# Altium schematic sheet Power_LDO_2V5.SchDoc: 2.5V LDO
size Letter; Engineer: Nathan Petersen; DocumentNumber: 6; Revision: v1.2; SheetNumber: 6; SheetTotal: 30
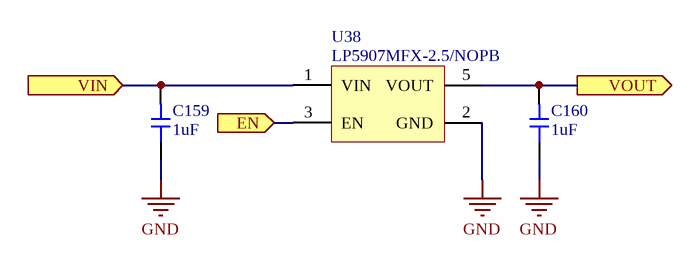
[diagram p0: Power_LDO_2V5.SchDoc]

## Parts
C159  value 1uF  [0603-CAP]  (hidden comment: Capacitor)
C160  value 1uF  [0603-CAP]  (hidden comment: Capacitor)
U38  LP5907MFX-2.5/NOPB  [SOT23-5]

## Ports
EN (in), VIN (in), VOUT (out)

## Nets
GND: C159.2 C160.2 U38.2(GND)
EN: U38.3(EN) ; port EN
VIN: C159.1 U38.1(VIN) ; port VIN
VOUT: C160.1 U38.5(VOUT) ; port VOUT

## Notes on the sheet
- Title:
- File:
- Sheet:
- of
- Revision:
- Time:
- Date:
- Engineer:

## Library data of the parts
C159 C160 = Capacitor: Manufacturer: Samsung; Manufacturer Part Number: CL10B105MO8NNWC; Voltage Rating: 16V; Tolerance: 20%; Supplier 1: Digi-Key; Supplier Part Number 1: 1276-6524-6-ND; Stock 1: 40000; Pricing 1: 1=0.1, 10=0.032, 100=0.0142, 500=0.01016, 1000=0.00798 (USD); Mount: Surface Mount; Case/Package: 0603; Case Code (Metric): 1608; Case Code (Imperial): 0603; Min Operating Temperature: -55°C; Max Operating Temperature: 125°C; Packaging: Tape and Reel; Capacitance: 1uF; Length: 0.063inch; Width: 0.031inch; Thickness: 0.035inch; ComponentLink1URL: http://www.samsungsem.com/kr/support/product-search/mlcc/CL10B105MO8NNWC.jsp; ComponentLink1Description: http://www.samsungsem.com/kr/support/product-search/mlcc/CL10B105MO8NNWC.jsp
U38 = LP5907MFX-2.5/NOPB: IC REG LINEAR 2.5V 250MA SOT23; Supplier 1: Digi-Key; Supplier Part Number 1: 296-40356-2-ND